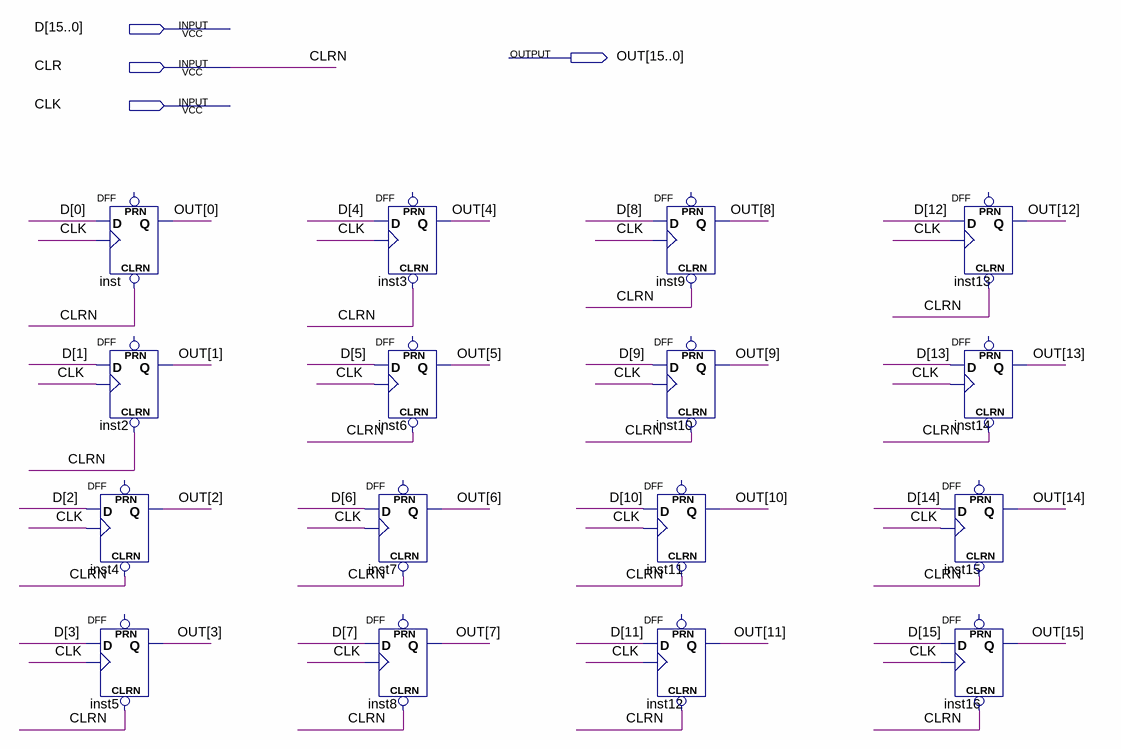
[diagram p0: schematic sheet]
// Quartus schematic Register.bdf as structural Verilog: 16 symbols, 4 pins
module Register (
  input  [15:0] D,
  input  CLR,
  input  CLK,
  output [15:0] OUT
);

  DFF inst (.CLRN(CLR), .CLK(CLK), .D(D[0]), .Q(OUT[0]));  // open: PRN
  DFF inst2 (.CLRN(CLR), .CLK(CLK), .D(D[1]), .Q(OUT[1]));  // open: PRN
  DFF inst4 (.CLRN(CLR), .CLK(CLK), .D(D[2]), .Q(OUT[2]));  // open: PRN
  DFF inst5 (.CLRN(CLR), .CLK(CLK), .D(D[3]), .Q(OUT[3]));  // open: PRN
  DFF inst3 (.CLRN(CLR), .CLK(CLK), .D(D[4]), .Q(OUT[4]));  // open: PRN
  DFF inst6 (.CLRN(CLR), .CLK(CLK), .D(D[5]), .Q(OUT[5]));  // open: PRN
  DFF inst7 (.CLRN(CLR), .CLK(CLK), .D(D[6]), .Q(OUT[6]));  // open: PRN
  DFF inst8 (.CLRN(CLR), .CLK(CLK), .D(D[7]), .Q(OUT[7]));  // open: PRN
  DFF inst9 (.CLRN(CLR), .CLK(CLK), .D(D[8]), .Q(OUT[8]));  // open: PRN
  DFF inst10 (.CLRN(CLR), .CLK(CLK), .D(D[9]), .Q(OUT[9]));  // open: PRN
  DFF inst11 (.CLRN(CLR), .CLK(CLK), .D(D[10]), .Q(OUT[10]));  // open: PRN
  DFF inst12 (.CLRN(CLR), .CLK(CLK), .D(D[11]), .Q(OUT[11]));  // open: PRN
  DFF inst13 (.CLRN(CLR), .CLK(CLK), .D(D[12]), .Q(OUT[12]));  // open: PRN
  DFF inst14 (.CLRN(CLR), .CLK(CLK), .D(D[13]), .Q(OUT[13]));  // open: PRN
  DFF inst15 (.CLRN(CLR), .CLK(CLK), .D(D[14]), .Q(OUT[14]));  // open: PRN
  DFF inst16 (.CLRN(CLR), .CLK(CLK), .D(D[15]), .Q(OUT[15]));  // open: PRN

  // Other names for the same wires on the sheet: CLRN = CLR
endmodule
